# EasyEDA Pro project ProPrj_4路分体电磁循迹模块.epro

# Schematic Schematic1
Board Name: Board1; Create Date: 2025-12-16; Page Name: P1; Project Name: 4路分体; Schematic Name: Schematic1; Update Date: 2025-12-16; Company: 嘉立创EDA; Page Size: A4; Version: V1.0
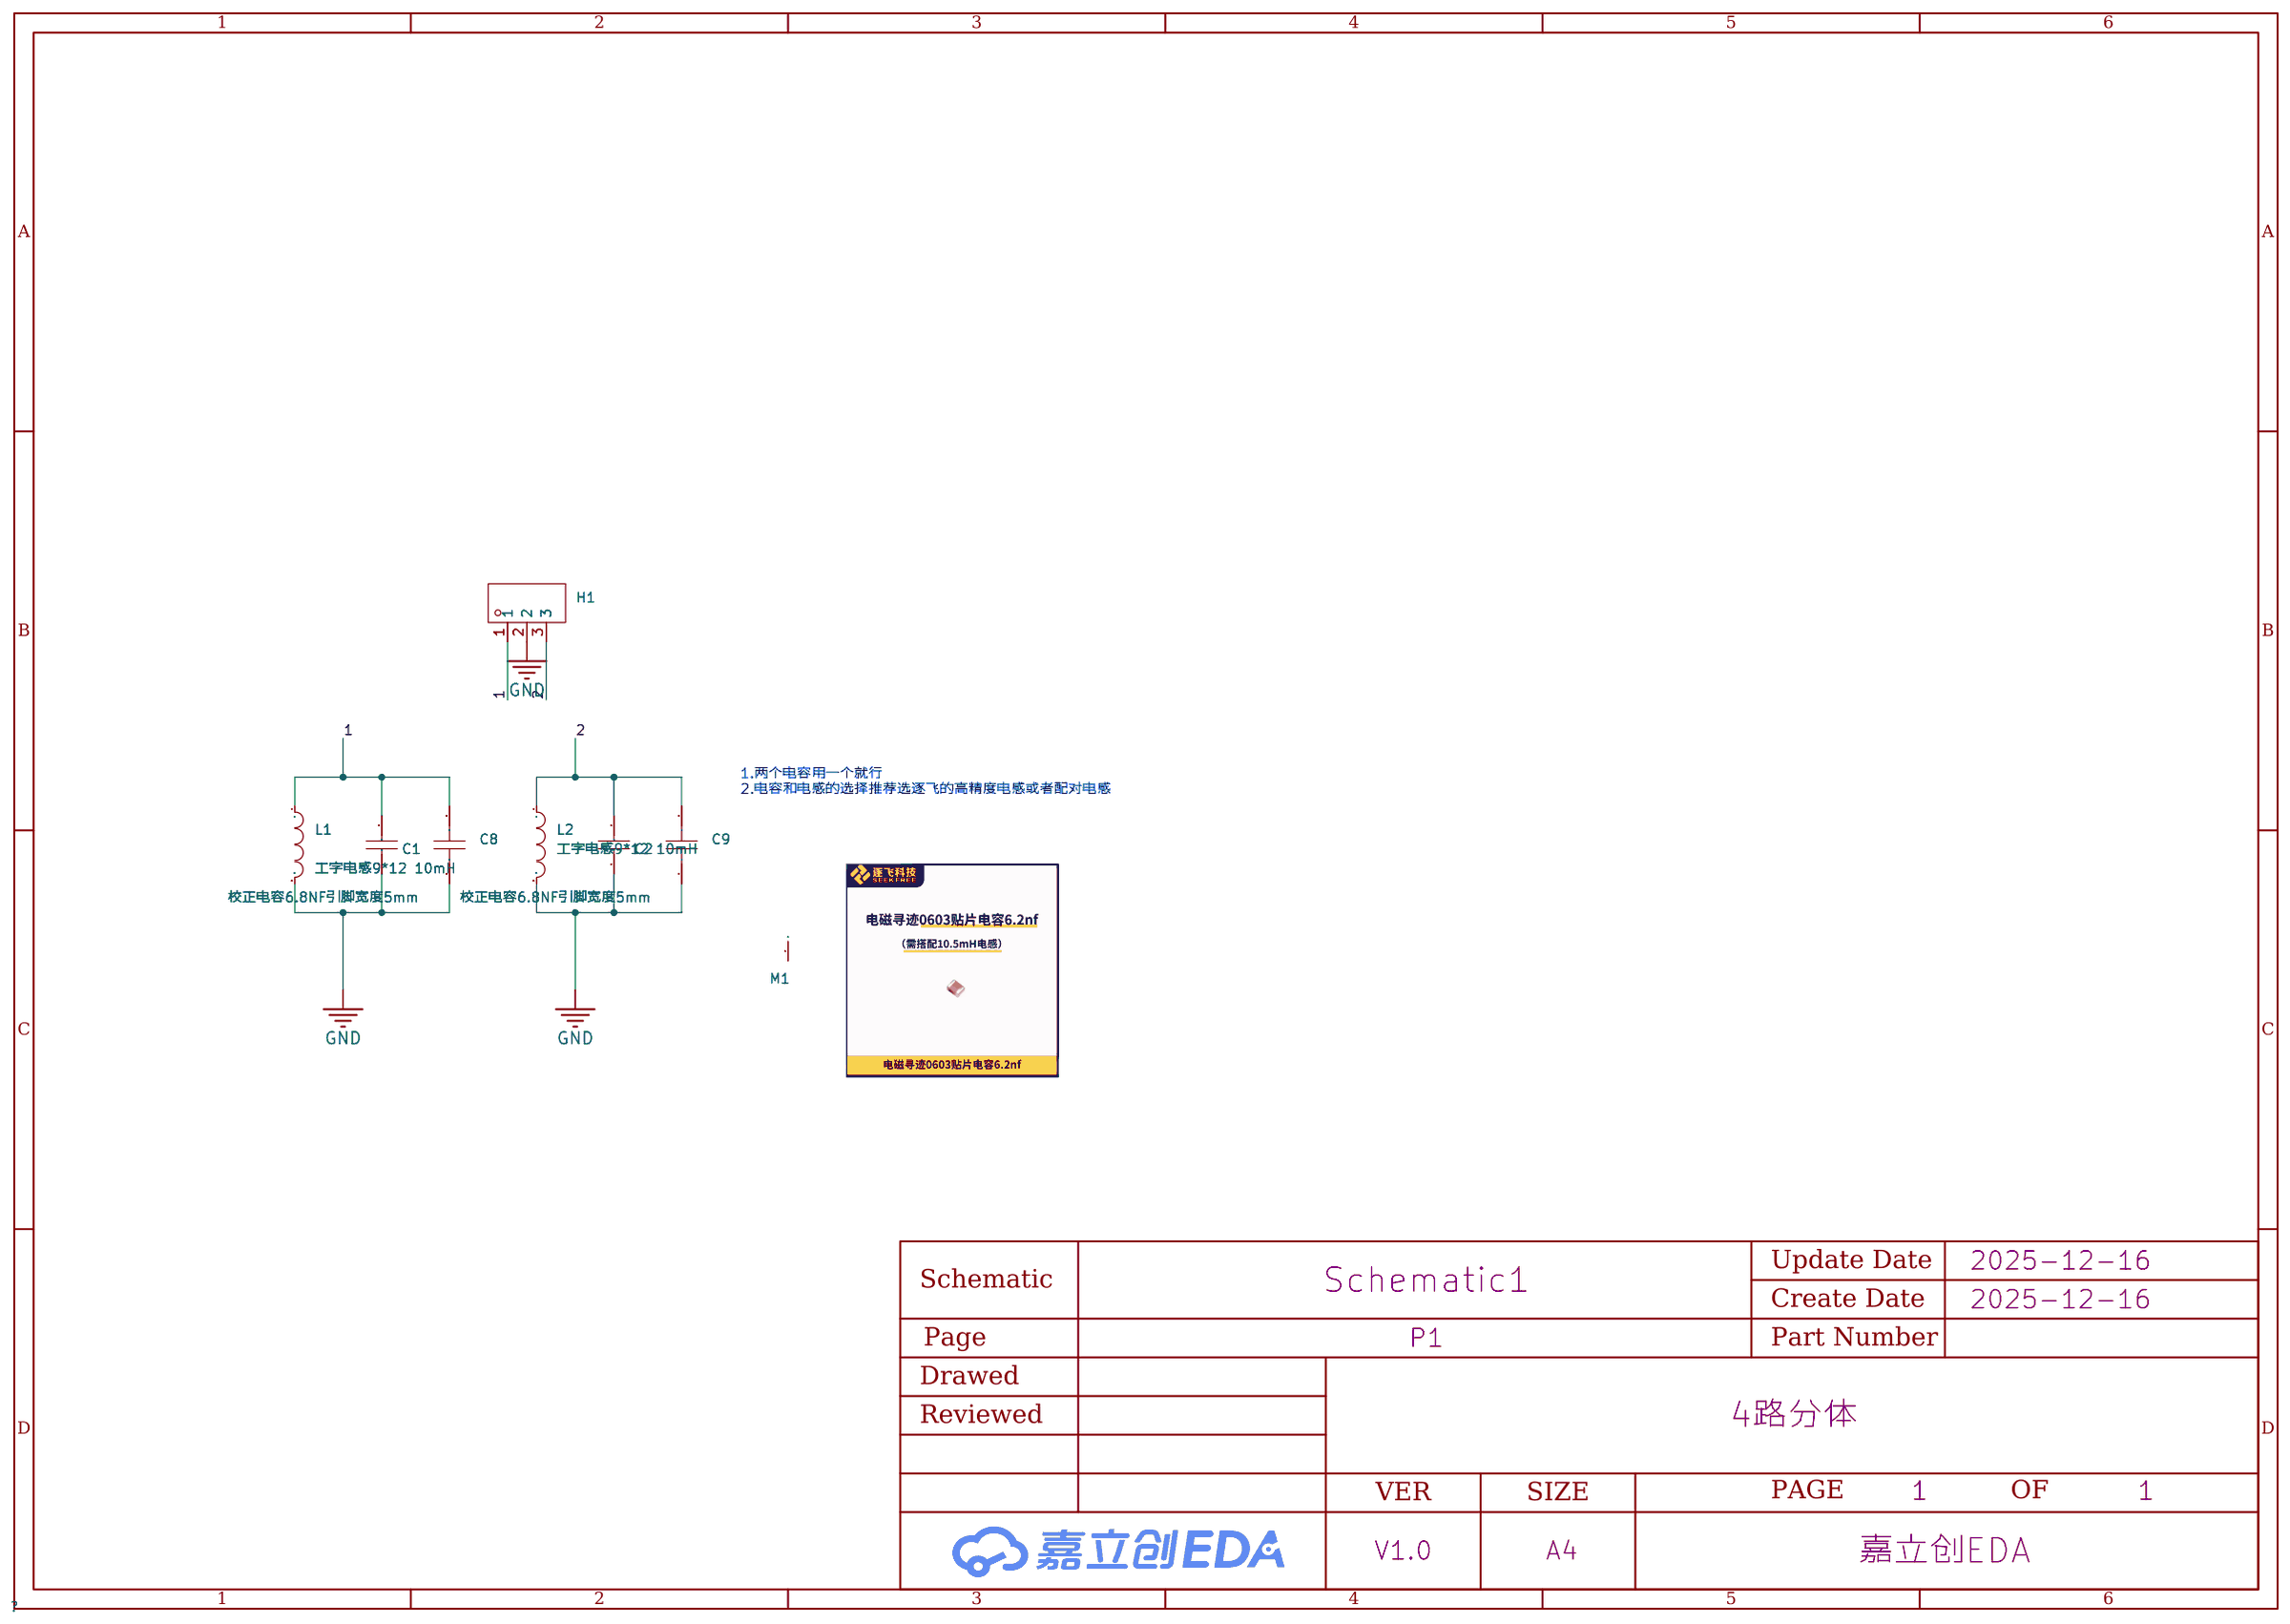
[diagram p0: schematic sheet]

## Parts
C1  校正电容6.8NF引脚宽度5mm  [CAP-TH_L7.0-W3.5-P5.00-D0.6]
C2  校正电容6.8NF引脚宽度5mm  [CAP-TH_L7.0-W3.5-P5.00-D0.6]
C8  100nF  [C0603]
C9  100nF  [C0603]
H1  -  [HDR-TH_3P-P2.54-V-M]
L1  工字电感9*12 10mH  [IND-TH_BD12.0-P5.00-D0.9]
L2  工字电感9*12 10mH  [IND-TH_BD12.0-P5.00-D0.9]
M1  MountHole  [M3-MountHole-Plated-D6]

## Library data of the parts
C1 C2 = 校正电容22NF（223） 100V  5%: LCSC Part Name: 22nF (223) ±5% 100V; Supplier Part: C26612; Supplier Footprint: Through Hole; JLCPCB Part Class: Extended Part; Datasheet: https://atta.szlcsc.com/upload/public/pdf/source/20151026/1457707500012.pdf; Supplier: LCSC
C8 C9 = CAP_0603: Supplier Footprint: 0603
H1 = HDR-M_2.54_1x3P: Supplier Part: C2937625; Supplier Footprint: 插件
L1 L2 = 工字电感9*1247uH/3A: Supplier Part: C9900010035; Supplier Footprint: IND-TH; JLCPCB Part Class: Extended Part; Datasheet: https://atta.szlcsc.comnull; Supplier: LCSC
M1 = MountHole: 固定孔; Library Name: TC264_主板_V2.6

## Nets
GND: C1.1 C2.1 C8.1 C9.1 H1.2 L1.2 L2.2
1: C1.2 C8.2 H1.1 L1.1
2: C2.2 C9.2 H1.3 L2.1

Not connected (* = marked no-connect by the designer): M1 1

## Notes on the sheet
- 1.两个电容用一个就行
  2.电容和电感的选择推荐选逐飞的高精度电感或者配对电感

# Schematic Schematic1_1
Board Name: Board1_1; Create Date: 2025-12-17; Page Name: P1; Project Name: 4路分体; Schematic Name: Schematic1_1; Update Date: 2025-12-17; Company: 嘉立创EDA; Page Size: A4; Version: V1.0
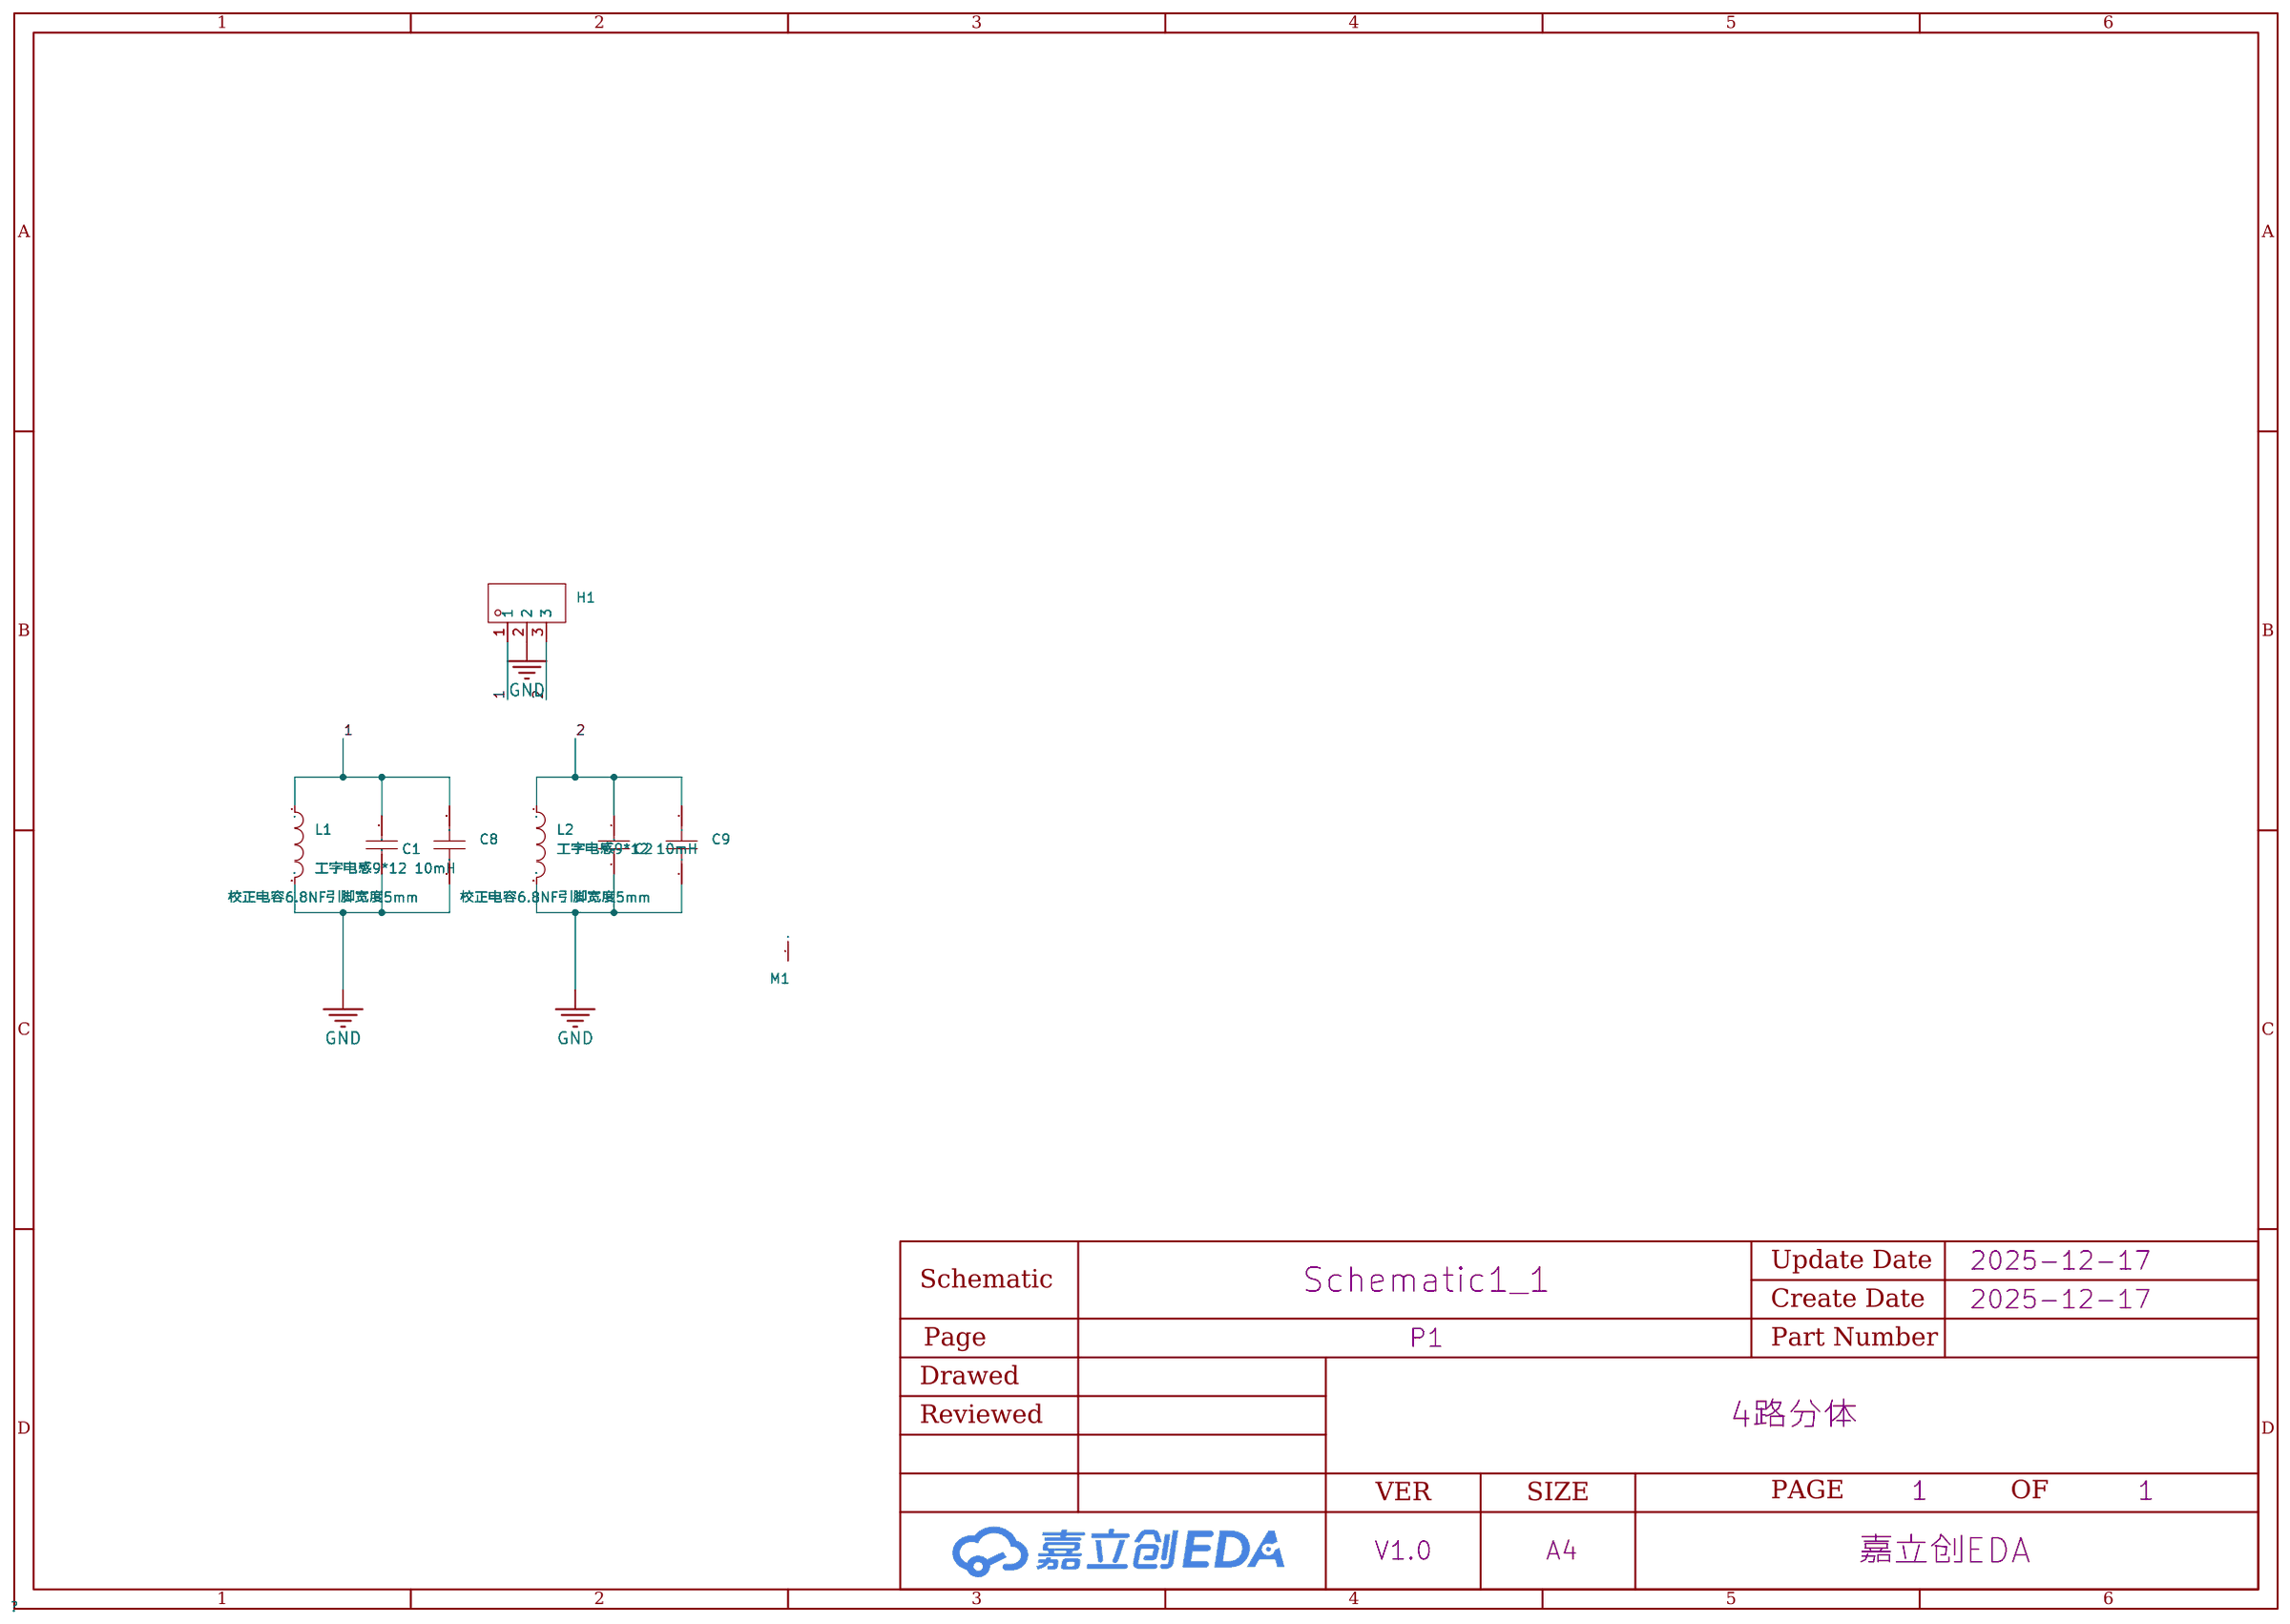
[diagram p1: schematic sheet]

## Parts
C1  校正电容6.8NF引脚宽度5mm  [CAP-TH_L7.0-W3.5-P5.00-D0.6]
C2  校正电容6.8NF引脚宽度5mm  [CAP-TH_L7.0-W3.5-P5.00-D0.6]
C8  100nF  [C0603]
C9  100nF  [C0603]
H1  -  [HDR-TH_3P-P2.54-V-M]
L1  工字电感9*12 10mH  [IND-TH_BD12.0-P5.00-D0.9]
L2  工字电感9*12 10mH  [IND-TH_BD12.0-P5.00-D0.9]
M1  MountHole  [M3-MountHole-Plated-D6]

## Library data of the parts
C1 C2 = 校正电容22NF（223） 100V  5%: LCSC Part Name: 22nF (223) ±5% 100V; Supplier Part: C26612; Supplier Footprint: Through Hole; JLCPCB Part Class: Extended Part; Datasheet: https://atta.szlcsc.com/upload/public/pdf/source/20151026/1457707500012.pdf; Supplier: LCSC
C8 C9 = CAP_0603: Supplier Footprint: 0603
H1 = HDR-M_2.54_1x3P: Supplier Part: C2937625; Supplier Footprint: 插件
L1 L2 = 工字电感9*1247uH/3A: Supplier Part: C9900010035; Supplier Footprint: IND-TH; JLCPCB Part Class: Extended Part; Datasheet: https://atta.szlcsc.comnull; Supplier: LCSC
M1 = MountHole: 固定孔; Library Name: TC264_主板_V2.6

## Nets
GND: C1.1 C2.1 C8.1 C9.1 H1.2 L1.2 L2.2
1: C1.2 C8.2 H1.1 L1.1
2: C2.2 C9.2 H1.3 L2.1

Not connected (* = marked no-connect by the designer): M1 1

# Board PCB1
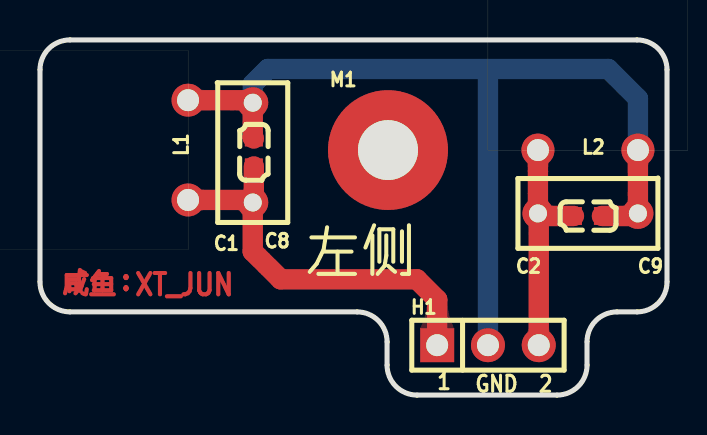
[diagram p2: board, top side]
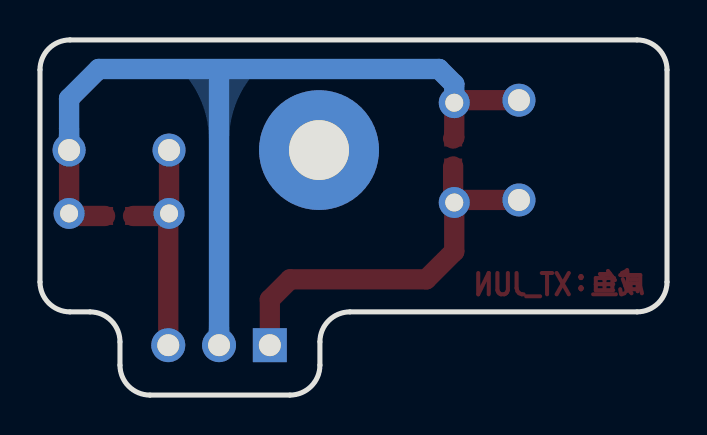
[diagram p3: board, bottom side, seen from below]

Outline 31.36 x 17.8 mm; copper layers: Top Layer, Bottom Layer. Coordinates in mm from the lower left corner of the outline.
Outline path: 0,16.3 0,5.67 arc(0.44,4.61) 1.5,4.17 15.86,4.17 arc(16.92,3.73) 17.36,2.67 17.36,1.5 arc(17.8,0.44) 18.86,0 25.86,0 arc(26.92,0.44) 27.36,1.5 27.36,2.67 arc(27.8,3.73) 28.86,4.17 29.86,4.17 arc(30.92,4.61) 31.36,5.67 31.36,16.3 arc(30.92,17.36) 29.86,17.8 1.5,17.8 arc(0.44,17.36) 0,16.3
Stack: Top Layer 0.035mm / Dielectric1 1.51mm FR4 er 4.5 / Bottom Layer 0.035mm

## Design rules (mm)
template: JLCPCB Capability(Two Layers Board)
spacing copperThickness1oz (default): track to track 0.102, other pairs 0.152 to 0.3
spacing copperThickness2oz: track to track 0.203, other pairs 0.152 to 0.3
track width copperThickness1oz (default): min 0.127, default 0.254, max 2.54
track width copperThickness2oz: min 0.203, default 0.254, max 2.54
differential pair differentialPair (default): width min 0.127, default 0.254, max 2.54; gap min 0.152, default 0.152
via viaSize (default): diameter min 0.5, default 0.61, max 10; hole min 0.3, default 0.305, max 6.3

## Placement (name value [footprint] x y rotation side)
C1  校正电容6.8NF引脚宽度5mm  [CAP-TH_L7.0-W3.5-P5.00-D0.6]  10.64 12.15 270 top
C2  校正电容6.8NF引脚宽度5mm  [CAP-TH_L7.0-W3.5-P5.00-D0.6]  27.41 9.1 180 top
C8  100nF  [C0603]  10.7 12.16 270 top
C9  100nF  [C0603]  27.41 8.98 180 top
H1  -  [HDR-TH_3P-P2.54-V-M]  22.41 2.5 0 top
L1  工字电感9*12 10mH  [IND-TH_BD12.0-P5.00-D0.9]  7.41 12.28 90 top
L2  工字电感9*12 10mH  [IND-TH_BD12.0-P5.00-D0.9]  27.41 12.28 0 top
M1  MountHole  [M3-MountHole-Plated-D6]  17.41 12.28 0 top

## Footprints (pads in the part's own frame, mm; a bottom-side part is the same pattern mirrored in y, then rotated)
C0603
  rect 0.8x0.9 smd: 1(-0.7,0) 2(0.7,0)
CAP-TH_L7.0-W3.5-P5.00-D0.6
  round 1.55 hole 0.9: 1(-2.5,0) 2(2.5,0)
HDR-TH_3P-P2.54-V-M
  rect 1.7x1.7 hole 1.1: 1(-2.54,0)
  round 1.7 hole 1.1: 2(0,0) 3(2.54,0)
IND-TH_BD12.0-P5.00-D0.9
  round 1.651 hole 1.101: 1(-2.5,0) 2(2.5,0)
M3-MountHole-Plated-D6
  round 6 hole 3: 1(0,0)

## Nets
As in the schematic.

Pads without a net: M1 1

## Routing (per net, layer and track width the routed paths; a pad name or vN(x,y) marks a point on that pad's centre or on a via; arc(x,y) is an arc through that point)
GND: length 47.4
  Top Layer w1.016: C8.1 10.64,12.91 C1.1 10.51,14.78 L1.2 ; L2.2 C2.1 29.78,8.98 C9.1
  Bottom Layer w1.016: C1.1 10.64,15.58 11.4,16.34 28.42,16.34 29.91,14.86 L2.2 ; 22.45,16.09 22.41,16.04 H1.2
1: length 20.1
  Top Layer w1.016: C1.2 10.64,7.2 12.04,5.8 18.85,5.8 19.87,4.79 H1.1 ; C1.2 10.51,9.78 L1.1 ; C1.2 10.7,9.71 C8.2
2: length 11.6
  Top Layer w1.016: 24.94,9.06 25.03,8.98 C9.2 ; 24.94,9.06 C2.2 L2.1 ; 24.94,9.06 H1.3

Small or netless copper shapes (teardrops, artwork), in the pictures only: 16 on Top Layer, 3 on Bottom Layer

## Text on the board
Top Layer: 咸鱼：XT_JUN
Top Solder Mask Layer: 咸鱼：XT_JUN
Top Silkscreen Layer: 1 | GND | 2 | 左侧

# Board PCB1_1
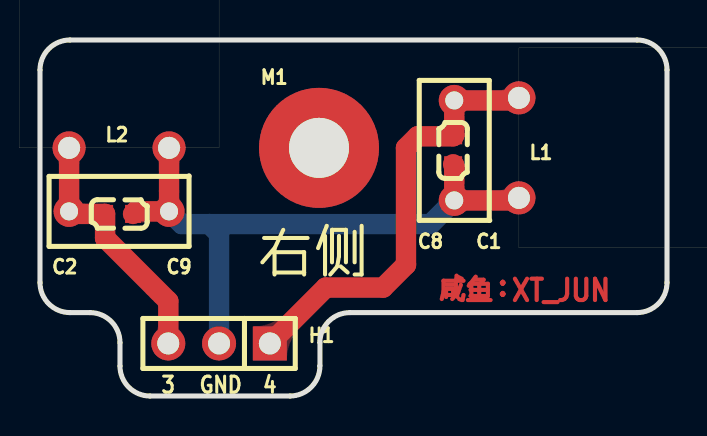
[diagram p4: board, top side]
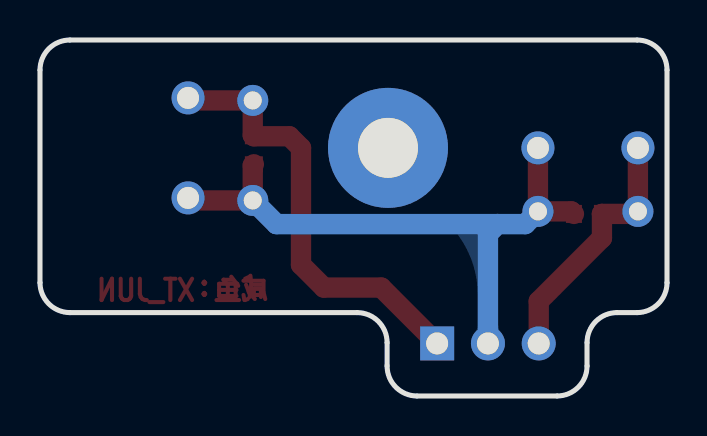
[diagram p5: board, bottom side, seen from below]

Outline 31.36 x 17.8 mm; copper layers: Top Layer, Bottom Layer. Coordinates in mm from the lower left corner of the outline.
Outline path: 0,16.3 arc(0.44,17.36) 1.5,17.8 29.86,17.8 arc(30.92,17.36) 31.36,16.3 31.36,5.67 arc(30.92,4.61) 29.86,4.17 15.5,4.17 arc(14.44,3.73) 14,2.67 14,1.5 arc(13.56,0.44) 12.5,0 5.5,0 arc(4.44,0.44) 4,1.5 4,2.67 arc(3.56,3.73) 2.5,4.17 1.5,4.17 arc(0.44,4.61) 0,5.67 0,16.3
Stack: Top Layer 0.035mm / Dielectric1 1.51mm FR4 er 4.5 / Bottom Layer 0.035mm

## Design rules (mm)
template: JLCPCB Capability(Two Layers Board)
spacing copperThickness1oz (default): track to track 0.102, other pairs 0.152 to 0.3
spacing copperThickness2oz: track to track 0.203, other pairs 0.152 to 0.3
track width copperThickness1oz (default): min 0.127, default 0.254, max 2.54
track width copperThickness2oz: min 0.203, default 0.254, max 2.54
differential pair differentialPair (default): width min 0.127, default 0.254, max 2.54; gap min 0.152, default 0.152
via viaSize (default): diameter min 0.5, default 0.61, max 10; hole min 0.3, default 0.305, max 6.3

## Placement (name value [footprint] x y rotation side)
C1  校正电容6.8NF引脚宽度5mm  [CAP-TH_L7.0-W3.5-P5.00-D0.6]  20.72 12.28 90 top
C2  校正电容6.8NF引脚宽度5mm  [CAP-TH_L7.0-W3.5-P5.00-D0.6]  3.96 9.23 180 top
C8  100nF  [C0603]  20.66 12.29 90 top
C9  100nF  [C0603]  3.96 9.1 180 top
H1  -  [HDR-TH_3P-P2.54-V-M]  8.96 2.63 180 top
L1  工字电感9*12 10mH  [IND-TH_BD12.0-P5.00-D0.9]  23.96 12.41 270 top
L2  工字电感9*12 10mH  [IND-TH_BD12.0-P5.00-D0.9]  3.96 12.41 0 top
M1  MountHole  [M3-MountHole-Plated-D6]  13.96 12.41 0 top

## Footprints (pads in the part's own frame, mm; a bottom-side part is the same pattern mirrored in y, then rotated)
C0603
  rect 0.8x0.9 smd: 1(-0.7,0) 2(0.7,0)
CAP-TH_L7.0-W3.5-P5.00-D0.6
  round 1.55 hole 0.9: 1(-2.5,0) 2(2.5,0)
HDR-TH_3P-P2.54-V-M
  rect 1.7x1.7 hole 1.1: 1(-2.54,0)
  round 1.7 hole 1.1: 2(0,0) 3(2.54,0)
IND-TH_BD12.0-P5.00-D0.9
  round 1.651 hole 1.101: 1(-2.5,0) 2(2.5,0)
M3-MountHole-Plated-D6
  round 6 hole 3: 1(0,0)

## Nets
As in the schematic.

Pads without a net: M1 1

## Routing (per net, layer and track width the routed paths; a pad name or vN(x,y) marks a point on that pad's centre or on a via; arc(x,y) is an arc through that point)
GND: length 31.3
  Top Layer w1.016: L1.2 23.83,9.78 C1.1 20.72,11.53 C8.1 ; L2.2 C2.1 4.78,9.23 C9.1
  Bottom Layer w1.016: 8.47,8.6 7.09,8.6 C2.1 ; 8.47,8.6 19.54,8.6 C1.1 ; 8.47,8.6 8.96,8.11 H1.2
1: length 22
  Top Layer w1.016: L1.1 23.83,14.78 C1.2 20.72,13.04 C8.2 18.89,12.99 18.31,12.41 18.31,6.56 17.16,5.42 14.29,5.42 H1.1
2: length 12.8
  Top Layer w1.016: H1.3 6.42,4.74 3.26,7.9 C9.2 1.58,9.1 C2.2 L2.1

Small or netless copper shapes (teardrops, artwork), in the pictures only: 15 on Top Layer, 3 on Bottom Layer

## Text on the board
Top Layer: 咸鱼：XT_JUN
Top Solder Mask Layer: 咸鱼：XT_JUN
Top Silkscreen Layer: 3 | GND | 4 | 右侧
